# EAGLE schematic led-neopixel-SK6812 (EAGLE 9.5.2)
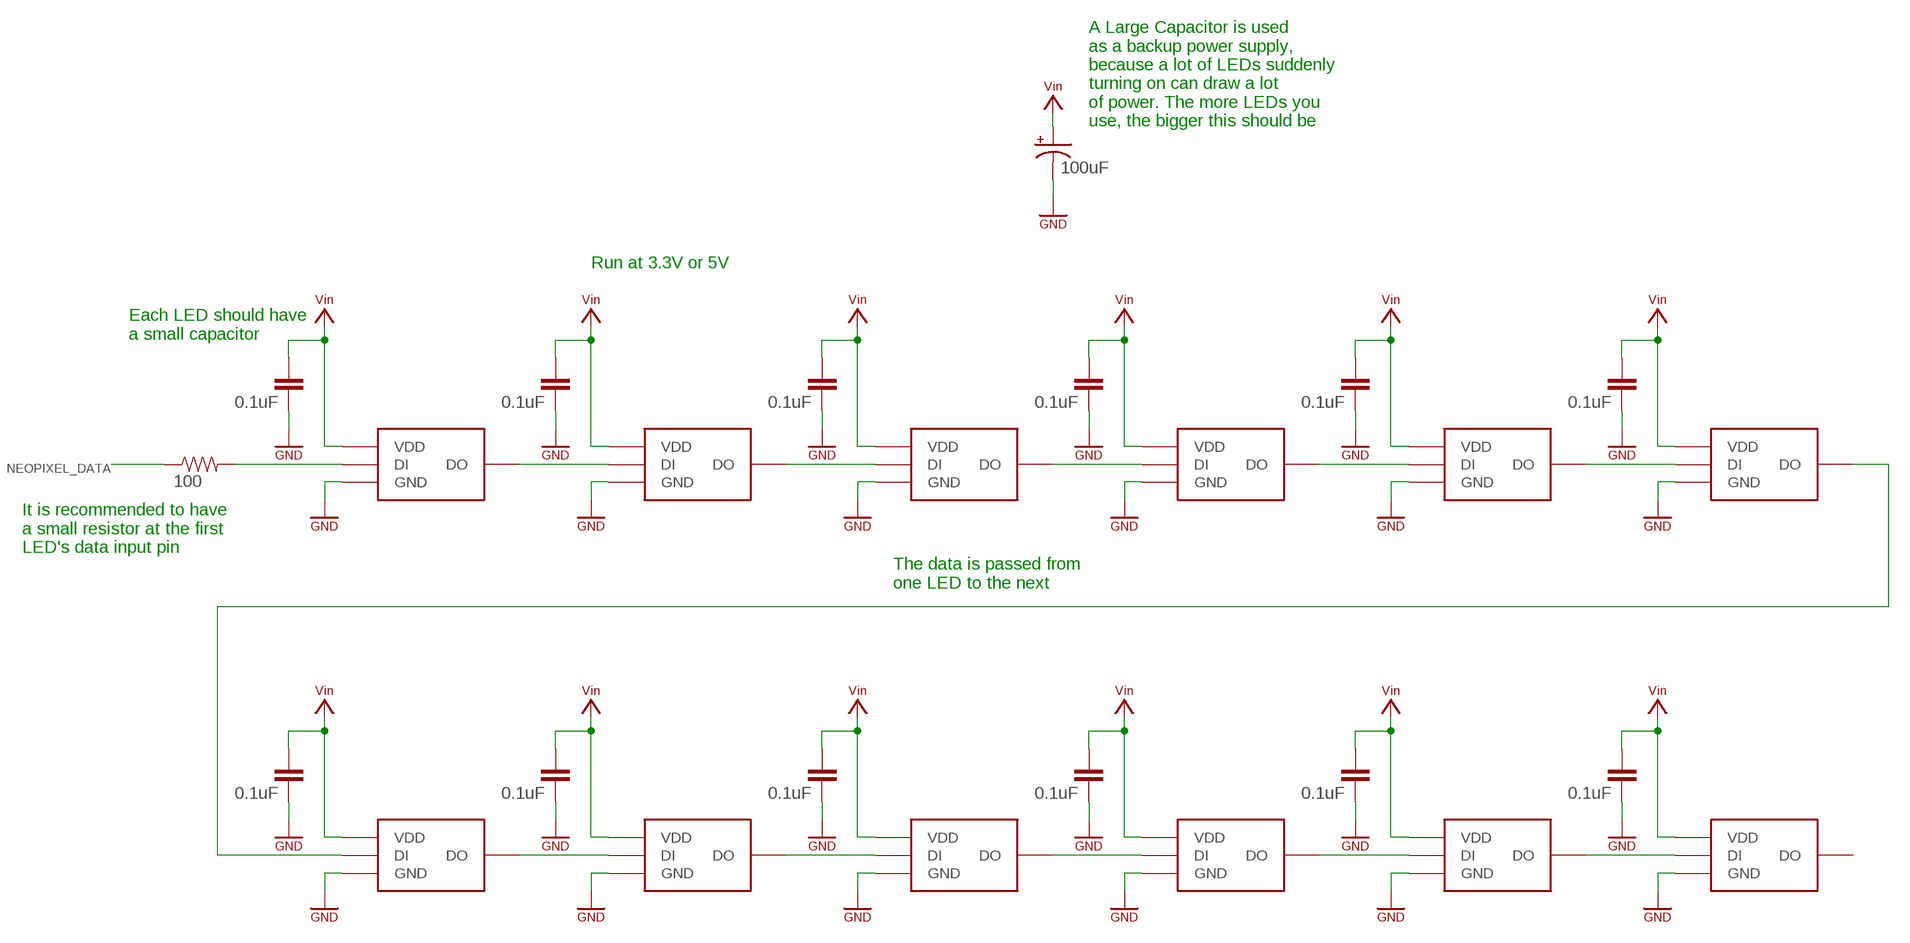
[diagram p0: schematic, sheet 1]

## Parts
C1  0.1uF  COMPONENT_CAP-0805  [0805]
C2  0.1uF  COMPONENT_CAP-0805  [0805]
C3  0.1uF  COMPONENT_CAP-0805  [0805]
C4  0.1uF  COMPONENT_CAP-0805  [0805]
C5  0.1uF  COMPONENT_CAP-0805  [0805]
C6  0.1uF  COMPONENT_CAP-0805  [0805]
C7  0.1uF  COMPONENT_CAP-0805  [0805]
C8  0.1uF  COMPONENT_CAP-0805  [0805]
C9  0.1uF  COMPONENT_CAP-0805  [0805]
C10  0.1uF  COMPONENT_CAP-0805  [0805]
C11  0.1uF  COMPONENT_CAP-0805  [0805]
C12  0.1uF  COMPONENT_CAP-0805  [0805]
C13  100uF  COMPONENT_CAP_POL-8MM  [CAP_RADIAL_CAN_8MM]
LED1  LED_NEOPIXEL_SK6812  [SK6812]
LED2  LED_NEOPIXEL_SK6812  [SK6812]
LED3  LED_NEOPIXEL_SK6812  [SK6812]
LED4  LED_NEOPIXEL_SK6812  [SK6812]
LED5  LED_NEOPIXEL_SK6812  [SK6812]
LED6  LED_NEOPIXEL_SK6812  [SK6812]
LED7  LED_NEOPIXEL_SK6812  [SK6812]
LED8  LED_NEOPIXEL_SK6812  [SK6812]
LED9  LED_NEOPIXEL_SK6812  [SK6812]
LED10  LED_NEOPIXEL_SK6812  [SK6812]
LED11  LED_NEOPIXEL_SK6812  [SK6812]
LED12  LED_NEOPIXEL_SK6812  [SK6812]
R1  100  COMPONENT_RESISTOR-0805  [0805]

## Nets
GND: C1.2 C2.2 C3.2 C4.2 C5.2 C6.2 C7.2 C8.2 C9.2 C10.2 C11.2 C12.2 C13.- LED1.3-GND(GND) LED2.3-GND(GND) LED3.3-GND(GND) LED4.3-GND(GND) LED5.3-GND(GND) LED6.3-GND(GND) LED7.3-GND(GND) LED8.3-GND(GND) LED9.3-GND(GND) LED10.3-GND(GND) LED11.3-GND(GND) LED12.3-GND(GND) ; supply symbol labelled SYMBOL_GND
N$1: LED1.4-DIN(DI) R1.2
N$2: LED1.2-DOUT(DO) LED2.4-DIN(DI)
N$3: LED2.2-DOUT(DO) LED3.4-DIN(DI)
N$4: LED3.2-DOUT(DO) LED4.4-DIN(DI)
N$5: LED4.2-DOUT(DO) LED5.4-DIN(DI)
N$6: LED5.2-DOUT(DO) LED6.4-DIN(DI)
N$7: LED6.2-DOUT(DO) LED7.4-DIN(DI)
N$8: LED7.2-DOUT(DO) LED8.4-DIN(DI)
N$9: LED8.2-DOUT(DO) LED9.4-DIN(DI)
N$10: LED9.2-DOUT(DO) LED10.4-DIN(DI)
N$11: LED10.2-DOUT(DO) LED11.4-DIN(DI)
N$12: LED11.2-DOUT(DO) LED12.4-DIN(DI)
NEOPIXEL_DATA: R1.1
VIN: C1.1 C2.1 C3.1 C4.1 C5.1 C6.1 C7.1 C8.1 C9.1 C10.1 C11.1 C12.1 C13.+ LED1.1-VDD(VDD) LED2.1-VDD(VDD) LED3.1-VDD(VDD) LED4.1-VDD(VDD) LED5.1-VDD(VDD) LED6.1-VDD(VDD) LED7.1-VDD(VDD) LED8.1-VDD(VDD) LED9.1-VDD(VDD) LED10.1-VDD(VDD) LED11.1-VDD(VDD) LED12.1-VDD(VDD) ; supply symbol labelled SYMBOL_VIN
Unconnected: LED12.2-DOUT(DO)

## Notes on the sheet
- A Large Capacitor is used
  as a backup power supply,
  because a lot of LEDs suddenly
  turning on can draw a lot
  of power. The more LEDs you
  use, the bigger this should be
- Run at 3.3V or 5V
- Each LED should have
  a small capacitor
- It is recommended to have
  a small resistor at the first
  LED's data input pin
- The data is passed from
  one LED to the next

## Library data of the parts
C1-C12 = homemade-hardware:COMPONENT_CAP: Capacitor Standard 0603 ceramic capacitor, and 0.1" leaded capacitor.
C13 = homemade-hardware:COMPONENT_CAP_POL: Capacitor Polarized These are standard SMD and PTH capacitors. Normally 47uF, 100uF, and 470uF in electrolytic and tantalum varieties. Always verify the external diameter of the through hole cap, it varies with capacity, voltage, and manufacturer. The EIA devices should be standard.
LED1-LED12 = homemade-hardware:LED_NEOPIXEL_SK6812: SK6812 <https://www.digikey.com/product-detail/en/adafruit-industries-llc/1655/1528-1104-ND/5154679>: NeoPixel Addressable LED
R1 = homemade-hardware:COMPONENT_RESISTOR